# EAGLE design schFile (EAGLE 6.4)
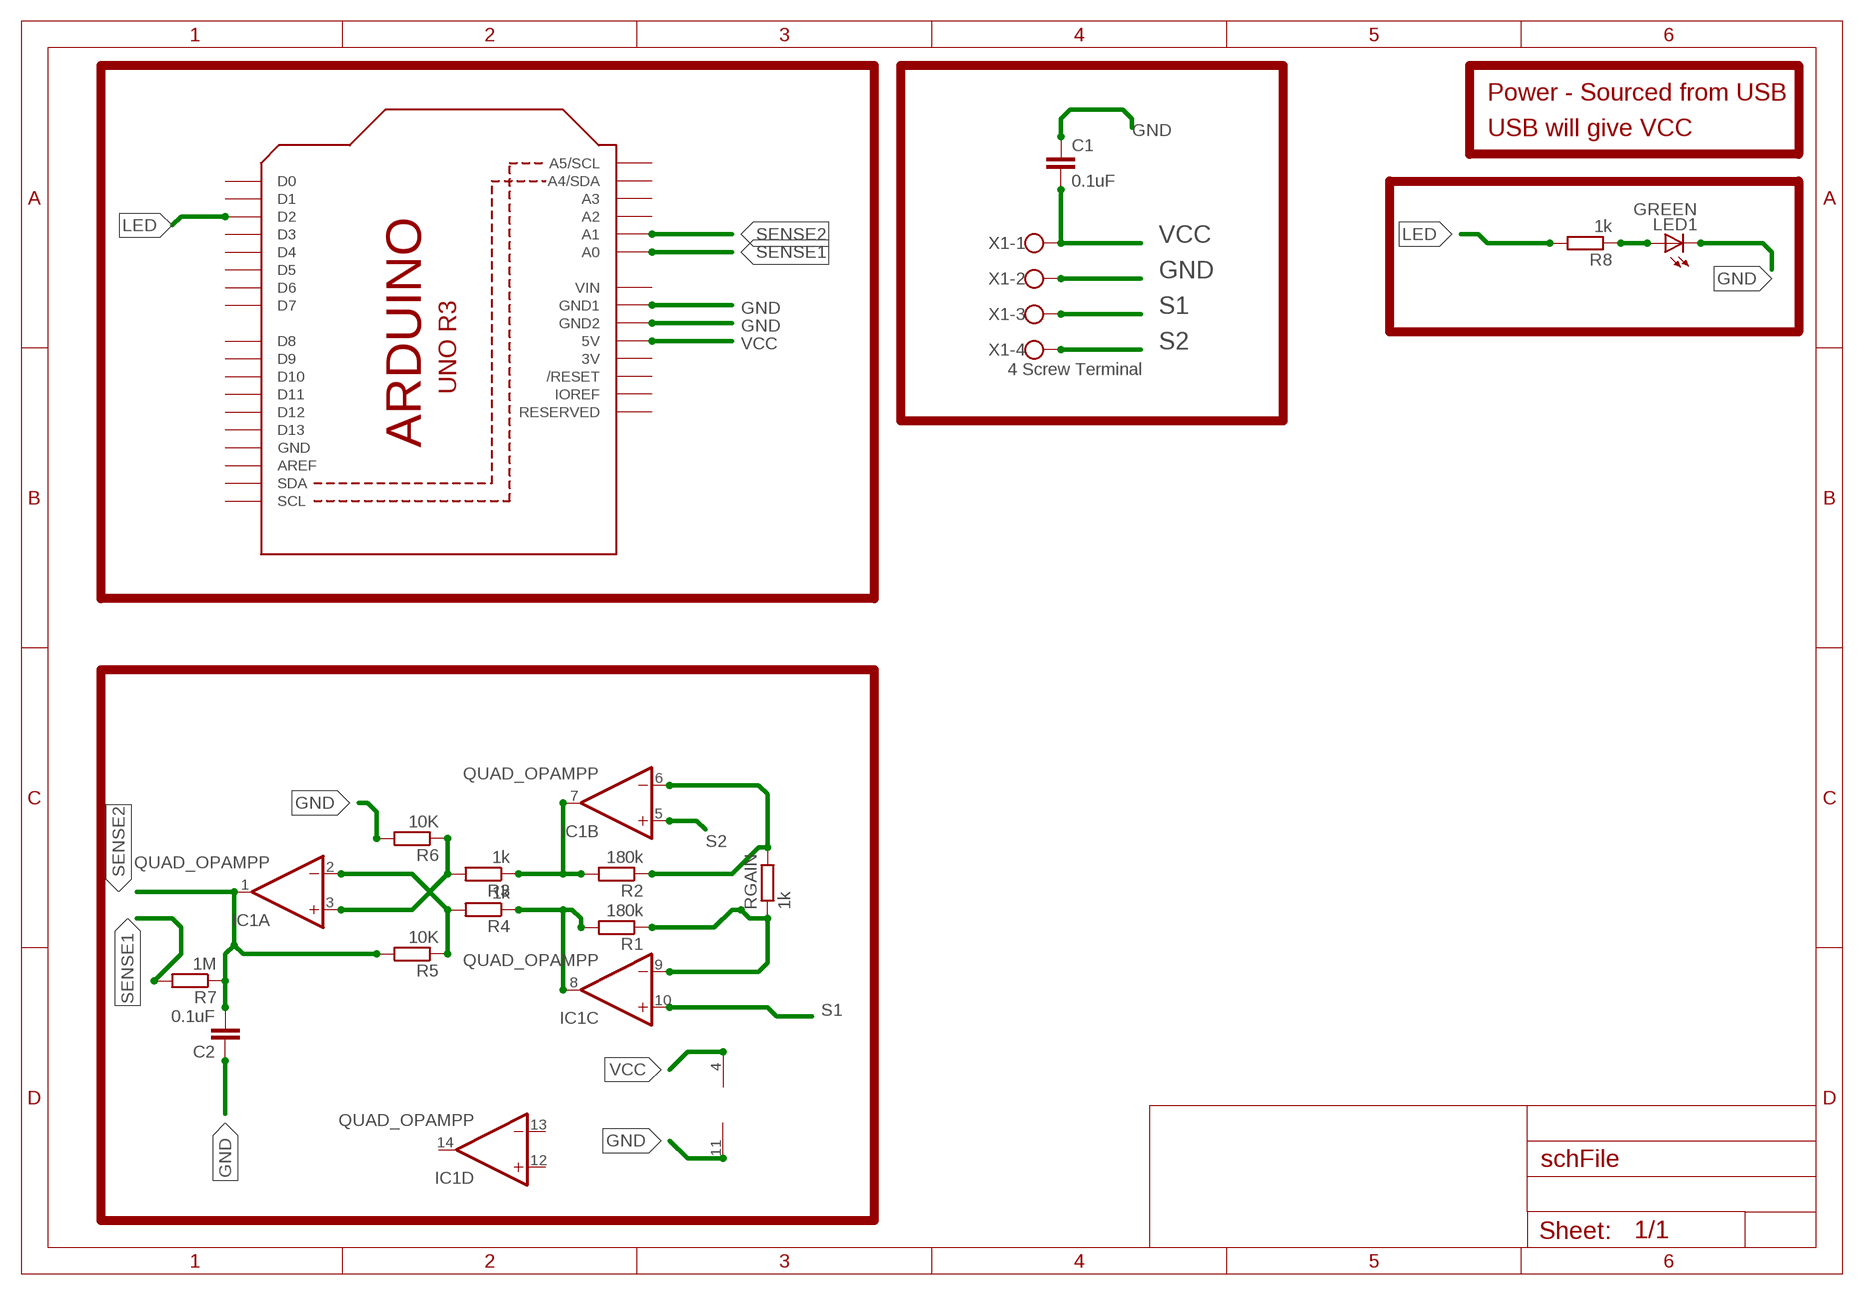
[diagram p0: schematic, sheet 1]

## Parts
ARDUINO  ARDUINOR3-BPLACE  [ARDUINOR3-BPLACE]
C1  0.1uF  CAPEZ  [CAP-PTH-SMALLEZ]
C2  0.1uF  CAPEZ  [CAP-PTH-SMALLEZ]
IC1  QUAD_OPAMPP  [DIL14]
LED1  GREEN  LED3MM  [LED3MM]
R1  180k  R-EU_0207/10  [0207/10]
R2  180k  R-EU_0207/10  [0207/10]
R3  1k  R-EU_0207/10  [0207/10]
R4  1k  R-EU_0207/10  [0207/10]
R5  10K  R-EU_0207/10  [0207/10]
R6  10K  R-EU_0207/10  [0207/10]
R7  1M  R-EU_0207/10  [0207/10]
R8  1k  R-EU_0207/10  [0207/10]
RGAIN  1k  R-EU_0207/10  [0207/10]
X1  4 Screw Terminal  W237-4  [W237-4]

## Nets
GND: ARDUINO.GND1 ARDUINO.GND2 C1.1 C2.1 IC1.11(P:V-) LED1.K(C) R6.2 X1.2
LED: ARDUINO.D2 R8.2
N$1: IC1.7(B:OUT) R2.2 R3.1
N$3: IC1.2(A:-IN) R4.2 R5.1
N$4: IC1.9(C:-IN) R1.1 RGAIN.1
N$5: LED1.A R8.1
N$6: IC1.3(A:+IN) R3.2 R6.1
N$7: IC1.6(B:-IN) R2.1 RGAIN.2
N$13: IC1.8(C:OUT) R1.2 R4.1
S1: IC1.10(C:+IN) X1.3
S2: IC1.5(B:+IN) X1.4
SENSE1: ARDUINO.A0 R7.2
SENSE2: ARDUINO.A1 C2.2 IC1.1(A:OUT) R5.2 R7.1
VCC: ARDUINO.5V C1.2 IC1.4(P:V+) X1.1
Unconnected: ARDUINO.A2 ARDUINO.A3 ARDUINO.A4(A4/SDA) ARDUINO.A5(A5/SCL) ARDUINO.AREF ARDUINO.D0 ARDUINO.D1 ARDUINO.D3 ARDUINO.D4 ARDUINO.D5 ARDUINO.D6 ARDUINO.D7 ARDUINO.D8 ARDUINO.D9 ARDUINO.D10 ARDUINO.D11 ARDUINO.D12 ARDUINO.D13 ARDUINO.IOREF ARDUINO.RESERVED ARDUINO.RESET(/RESET) ARDUINO.SCL ARDUINO.SDA IC1.12(D:+IN) IC1.13(D:-IN) IC1.14(D:OUT)

## Notes on the sheet
- Power - Sourced from USB
- USB will give VCC

## Power pins joined to a net without a drawn wire
3V: ARDUINO.3V
GND: ARDUINO.GND
VIN: ARDUINO.VIN

## Library data of the parts
ARDUINO = adafruit:ARDUINOR3: This is a new object for the new Arduino R3 - with extra pins that you may want to use (such as IOref, and duplicated A4/A5
C1 C2 = SparkFun-Capacitors:CAP: Capacitor Standard 0603 ceramic capacitor, and 0.1" leaded capacitor.
IC1 = adafruit:QUAD_OPAMP: OP AMP Standard quad package
LED1 = adafruit:LED: LED OSRAM: - CHIPLED LG R971, LG N971, LY N971, LG Q971, LY Q971, LO R971, LY R971 LH N974, LH R974 LS Q976, LO Q976, LY Q976 LO Q996 - Hyper CHIPLED LW Q18S LB Q993, LB Q99A, LB R99A - SideLED LS A670, LO A670, LY A670, LG A670, LP A670 LB A673, LV A673, LT A673, LW A673 LH A674 LY A675 LS A676, LA A676, LO A676, LY A676, LW A676 LS A679, LY A679, LG A679 - Hyper Micro SIDELED® LS Y876, LA Y876, LO Y876, LY Y876 LT Y87S - SmartLED LW L88C, LW L88S LB L89C, LB L89S, LG L890 LS L89K, LO L89K, LY L89K LS L896, LA L896, LO L896, LY L896 - TOPLED LS T670, LO T670, LY T670, LG T670, LP T670 LSG T670, LSP T670, LSY T670, LOP T670, LYG T670 LG T671, LOG T671, LSG T671 LB T673, LV T673, LT T673, LW T673 LH T674 LS T676, LA T676, LO T676, LY T676, LB T676, LH T676, LSB T676, LW T676 LB T67C, LV T67C, LT T67C, LS T67K, LO T67K, LY T67K, LW E67C LS E67B, LA E67B, LO E67B, LY E67B, LB E67C, LV E67C, LT E67C LW T67C LS T679, LY T679, LG T679 LS T770, LO T770, LY T770, LG T770, LP T770 LB T773, LV T773, LT T773, LW T773 LH T774 LS E675, LA E675, LY E675, LS T675 LS T776, LA T776, LO T776, LY T776, LB T776 LHGB T686 LT T68C, LB T68C - Hyper Mini TOPLED® LB M676 - Mini TOPLED Santana® LG M470 LS M47K, LO M47K, LY M47K Source: http://www.osram.convergy.de/
R1-R8 RGAIN = resistor:R-EU_: RESISTOR, European symbol
X1 = con-wago-500:W237-4: WAGO SCREW CLAMP; OC_FARNELL: unknown; OC_NEWARK: unknown

## Net classes
0 default: width 0.406 mm
1 GND: width 0.813 mm
2 VCC: width 0.61 mm

## Board
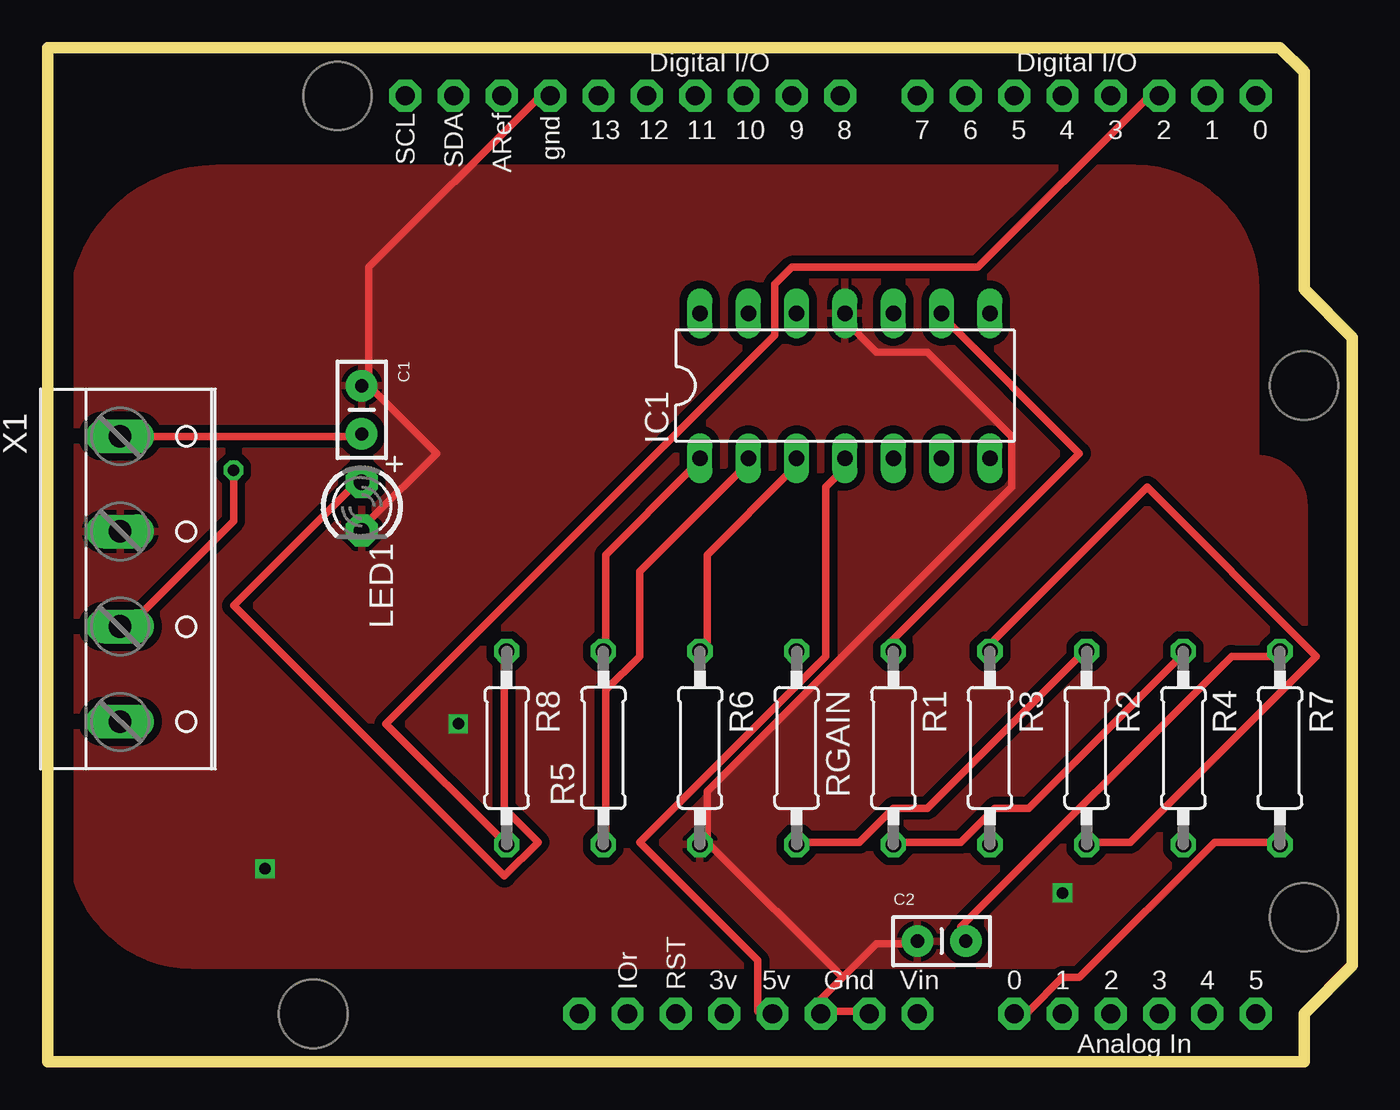
[diagram p1: board, top side]
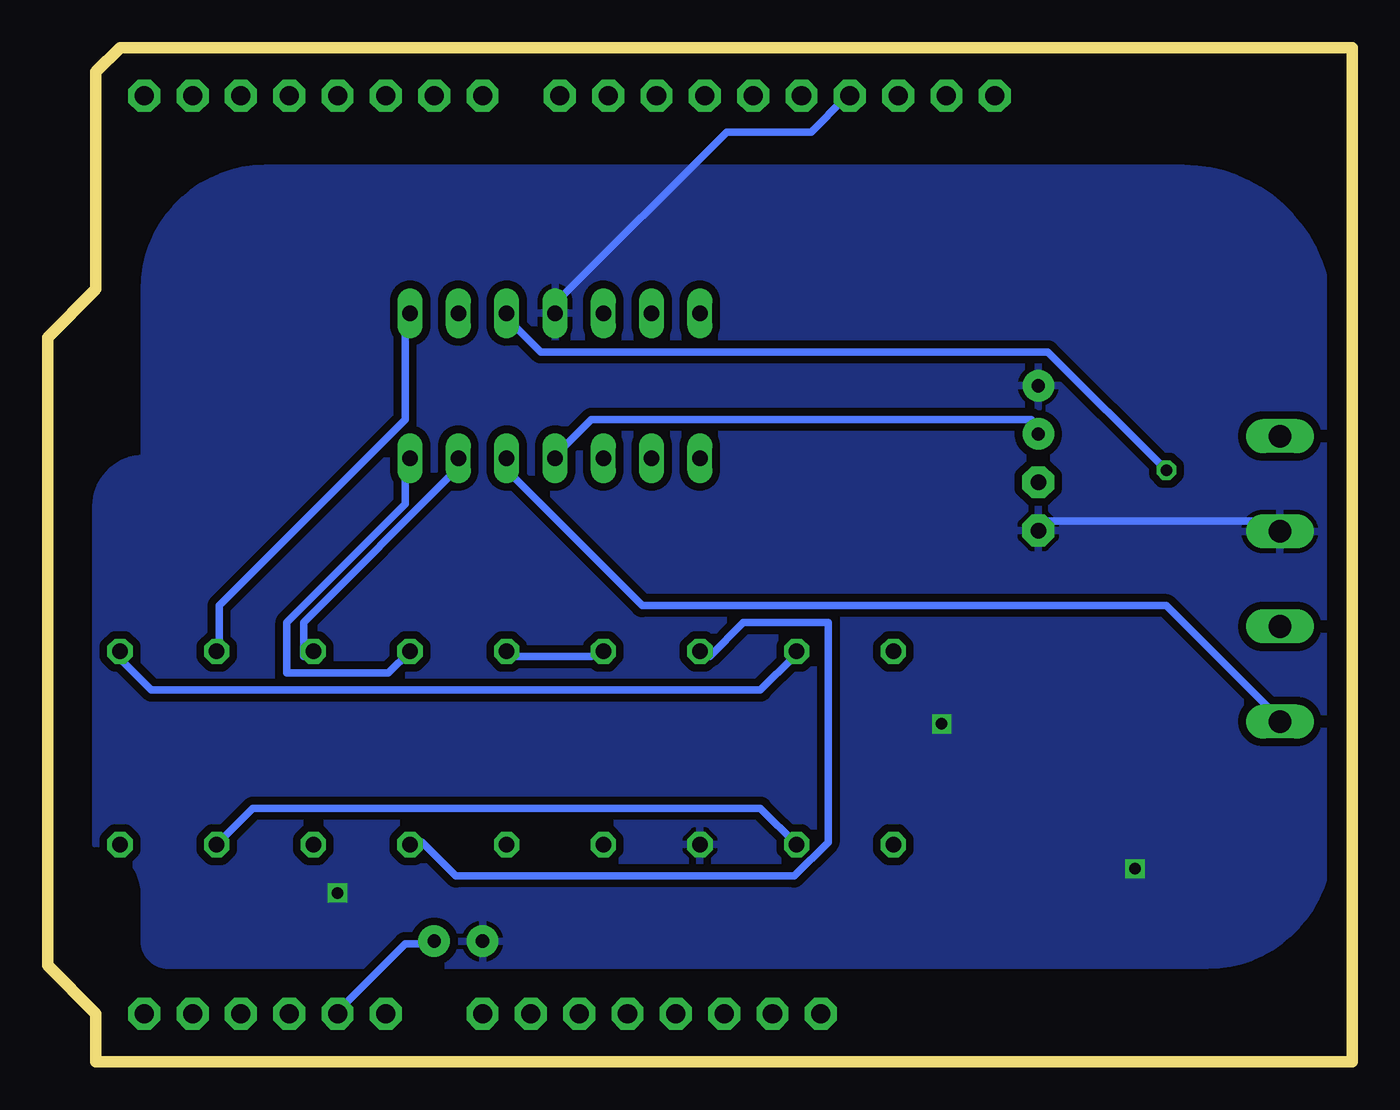
[diagram p2: board, bottom side, seen from below]

Size 68.58 x 53.34 mm. Coordinates in mm from the lower left corner, seen from the top.
Outline: 0,53.34 64.77,53.34 66.04,52.07 66.04,40.64 68.58,38.1 68.58,5.08 66.04,2.54 66.04,0 0,0 0,53.34
Copper layers (1*16): Top 0.035mm / dielectric 1.5mm / Bottom 0.035mm
Design rules "default": minimum track width 10mil, minimum drill 24mil, track to track 8mil, track to pad 8mil, pad to pad 8mil, via to via 8mil, smd to smd 8mil, copper to edge 40mil, drill to drill 8mil, minimum pad ring 10mil, minimum via ring 8mil, stop-mask expansion 4mil, vias tented up to drill 0mil, thermal gap 10mil

### Footprints (pad centres in the part's own frame; a part is rotated, then mirrored left to right if it is on the bottom)
ARDUINOR3-BPLACE = drill 1 pad 1.676 octagon: 3V 35.56,2.54; 5V 38.1,2.54; A0 50.8,2.54; A1 53.34,2.54; A2 55.88,2.54; A3 58.42,2.54; A4 60.96,2.54; A5 63.5,2.54; AREF 23.876,50.8; D0 63.5,50.8; D1 60.96,50.8; D2 58.42,50.8; D3 55.88,50.8; D4 53.34,50.8; D5 50.8,50.8; D6 48.26,50.8; D7 45.72,50.8; D8 41.656,50.8; D9 39.116,50.8; D10 36.576,50.8; D11 34.036,50.8; D12 31.496,50.8; D13 28.956,50.8; GND 26.416,50.8; GND1 43.18,2.54; GND2 40.64,2.54; IOREF 30.48,2.54; RESERVED 27.94,2.54; RESET 33.02,2.54; SCL 18.796,50.8; SDA 21.336,50.8; VIN 45.72,2.54
CAP-PTH-SMALLEZ = drill 0.7 pad 1.651: 1 0,0; 2 2.54,0
DIL14 = drill 0.813 long: 1 -7.62,-3.81; 2 -5.08,-3.81; 3 -2.54,-3.81; 4 0,-3.81; 5 2.54,-3.81; 6 5.08,-3.81; 7 7.62,-3.81; 8 7.62,3.81; 9 5.08,3.81; 10 2.54,3.81; 11 0,3.81; 12 -2.54,3.81; 13 -5.08,3.81; 14 -7.62,3.81
LED3MM = drill 0.813 pad 1.676 octagon: A -1.27,0; K 1.27,0
0207/10 = drill 0.813 octagon: 1 -5.08,0; 2 5.08,0
W237-4 = drill 1.194 long: 1 -7.5,-1.27; 2 -2.5,-1.27; 3 2.5,-1.27; 4 7.5,-1.27

### Placement (x,y rotation side)
ARDUINO  0,0 0 top
C1  16.51,35.56 270 top
C2  45.72,6.35 0 top
IC1  41.91,35.56 0 top
LED1  16.51,29.21 270 top
R1  44.45,16.51 270 top
R2  54.61,16.51 270 top
R3  49.53,16.51 270 top
R4  59.69,16.51 270 top
R5  29.21,16.51 90 top
R6  34.29,16.51 270 top
R7  64.77,16.51 270 top
R8  24.13,16.51 270 top
RGAIN  39.37,16.51 270 top
X1  5.08,25.4 270 top

### Tracks (layer width: path | path; a pad name or v marks a point on that pad's centre or on a via)
GND  (via drill 0.6)
  Top 0.406: 16.89,35.56 20.45,32 16.89,28.45 LED1.K | 41.78,4.45 34.67,11.56 | 41.78,4.45 40.01,2.67 ARDUINO.GND2 40.89,2.67 42.67,2.67 ARDUINO.GND1 | 41.78,4.45 43.56,6.22 45.34,6.22 C2.1 | 34.67,11.56 34.67,14.22 50.67,30.23 50.67,32.89 46.23,37.34 43.56,37.34 41.78,39.12 IC1.11 | 34.67,11.56 R6.2 | 16.89,35.56 16.89,41.78 25.78,50.67 ARDUINO.GND | 16.89,35.56 C1.1
  Bottom 0.406: X1.2 4.45,28.45 16,28.45 LED1.K | IC1.11 41.78,40.01 32.89,48.9 28.45,48.9 26.67,50.67 ARDUINO.GND
  other vias: 11.43,10.16 21.59,17.78 53.34,8.89
  pour Top (isolate 0.406): 1.27,39.37 arc-90 8.89,46.99 13.97,46.99 57.15,46.99 arc-90 63.5,40.64 63.5,31.75 arc-90 66.04,29.21 66.04,11.43 arc90 63.5,8.89 63.5,6.35 arc-90 62.23,5.08 60.96,5.08 7.62,5.08 arc-90 1.27,11.43 1.27,12.7
  pour Bottom (isolate 0.406): 1.27,39.37 arc-90 8.89,46.99 13.97,46.99 57.15,46.99 arc-90 63.5,40.64 63.5,31.75 arc-90 66.04,29.21 66.04,11.43 arc90 63.5,8.89 63.5,7.62 63.5,6.35 arc-90 62.23,5.08 60.96,5.08 7.62,5.08 arc-90 1.27,11.43 1.27,12.7
LED
  Top 0.406: R8.2 17.78,17.78 38.23,38.23 38.23,40.89 39.12,41.78 48.9,41.78 57.78,50.67 ARDUINO.D2
N$1
  Top 0.406: R2.2 55.12,11.56 56.9,11.56 66.67,21.34 57.78,30.23 49.78,22.23 R3.1
  Bottom 0.406: R3.1 50.67,20.45 56.01,20.45 56.01,23.11 49.78,29.34 49.78,31.11 IC1.7
N$3
  Top 0.406: R5.1 29.34,11.56 29.34,19.56 31.11,21.34 31.11,25.78 36.45,31.11 IC1.2
  Bottom 0.406: R4.2 57.78,13.34 31.11,13.34 R5.1
N$4
  Top 0.406: IC1.9 47.12,39.12 54.23,32 44.45,22.23 R1.1
  Bottom 0.406: RGAIN.1 40.01,21.34 44.45,21.34 R1.1
N$5
  Top 0.406: R8.1 24,21.34 24,13.34 25.78,11.56 24,9.78 9.78,24 16,30.23 LED1.A
N$6
  Top 0.406: R6.1 34.67,21.34 34.67,26.67 39.12,31.11 IC1.3
  Bottom 0.406: R3.2 48.9,11.56 47.12,9.78 29.34,9.78 27.56,11.56 27.56,23.11 32,23.11 33.78,21.34 R6.1
N$7
  Top 0.406: RGAIN.2 40.01,11.56 42.67,11.56 44.45,13.34 46.23,13.34 54.23,21.34 R2.1
  Bottom 0.406: IC1.6 47.12,31.11 55.12,23.11 55.12,21.34 R2.1
N$13
  Top 0.406: R1.2 44.45,11.56 48.01,11.56 49.78,13.34 51.56,13.34 59.56,21.34 R4.1
  Bottom 0.406: IC1.8 49.78,39.12 49.78,33.78 59.56,24 59.56,22.23 R4.1
S1  (via drill 0.61)
  Top 0.406: v9.78,31.11 9.78,28.45 4.45,23.11 X1.3
  Bottom 0.406: v9.78,31.11 16,37.34 42.67,37.34 44.45,39.12 IC1.10
S2
  Bottom 0.406: IC1.5 44.45,31.11 37.34,24 9.78,24 4.45,18.67 X1.4
SENSE1
  Top 0.406: R7.2 64.9,11.56 61.34,11.56 54.23,4.45 53.34,4.45 51.56,2.67 ARDUINO.A0
SENSE2
  Top 0.406: R5.2 29.34,22.23 29.34,26.67 33.78,31.11 IC1.1 | R7.1 64.9,21.34 62.23,21.34 48.01,7.11 C2.2
  Bottom 0.406: ARDUINO.A1 53.34,2.67 49.78,6.22 48.9,6.22 C2.2 | R5.2 29.34,21.34 31.11,19.56 63.12,19.56 64.9,21.34 R7.1
VCC
  Top 0.406: ARDUINO.5V 37.34,2.67 37.34,5.33 31.11,11.56 40.89,21.34 40.89,30.23 41.78,31.11 IC1.4 | X1.1 4.45,32.89 16,32.89 C1.2
  Bottom 0.406: IC1.4 41.78,32 40.01,33.78 16.89,33.78 C1.2